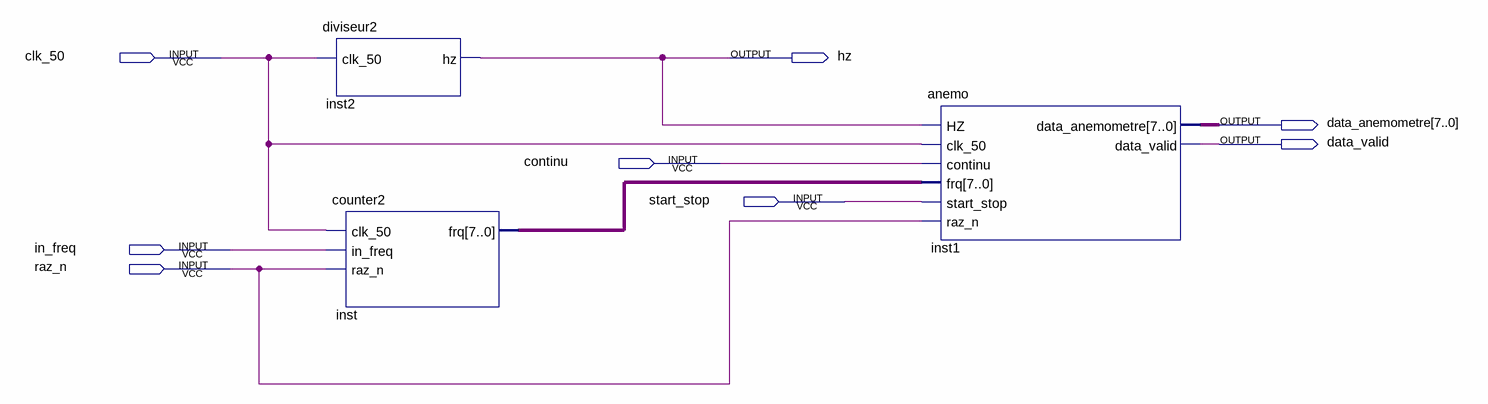
[diagram p0: schematic sheet]
// Quartus schematic anemometre2.bdf as structural Verilog: 3 symbols, 8 pins
module anemometre2 (
  input  clk_50,
  input  continu,
  input  start_stop,
  input  in_freq,
  input  raz_n,
  output hz,
  output [7:0] data_anemometre,
  output data_valid
);

  wire [7:0] inst_frq;

  diviseur2 inst2 (.clk_50(clk_50), .hz(hz));
  counter2 inst (.clk_50(clk_50), .in_freq(in_freq), .raz_n(raz_n), .frq(inst_frq));
  anemo inst1 (
    .HZ(hz), .clk_50(clk_50), .continu(continu), .frq(inst_frq), .start_stop(start_stop), .raz_n(raz_n),
    .data_anemometre(data_anemometre), .data_valid(data_valid));
endmodule
